# EAGLE design SuperDMG (EAGLE 7.3.0)
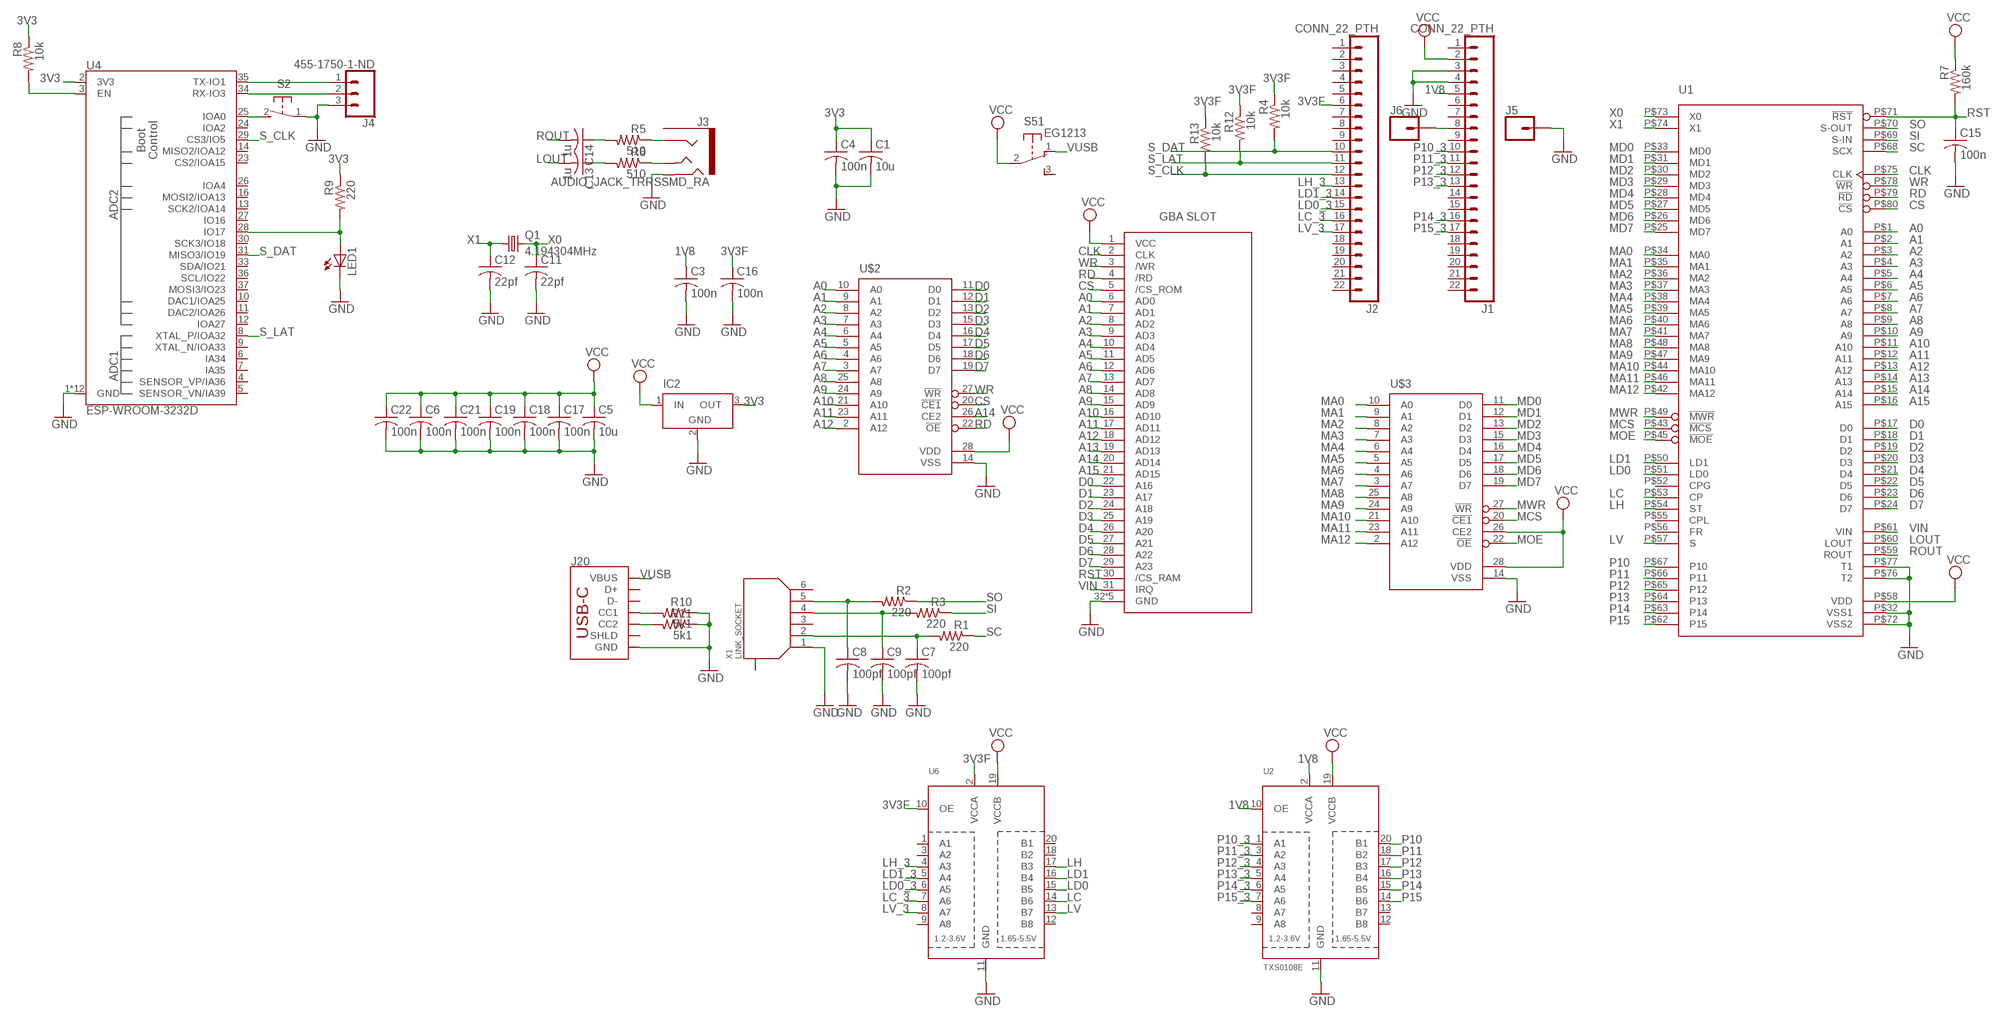
[diagram p0: schematic, sheet 1]

## Parts
C1  10u  C-USC0805  [C0805]
C3  100n  C-USC0805  [C0805]
C4  100n  C-USC0805  [C0805]
C5  10u  C-USC0805  [C0805]
C6  100n  C-USC0805  [C0805]
C7  100pf  C-USC0805  [C0805]
C8  100pf  C-USC0805  [C0805]
C9  100pf  C-USC0805  [C0805]
C11  22pf  C-USC0805  [C0805]
C12  22pf  C-USC0805  [C0805]
C13  1u  C-USC0805  [C0805]
C14  1u  C-USC0805  [C0805]
C15  100n  C-USC0805  [C0805]
C16  100n  C-USC0805  [C0805]
C17  100n  C-USC0805  [C0805]
C18  100n  C-USC0805  [C0805]
C19  100n  C-USC0805  [C0805]
C21  100n  C-USC0805  [C0805]
C22  100n  C-USC0805  [C0805]
IC2  LT1129CST5  [SOT223]
J1  CONN_22_PTH  [1X22]
J2  CONN_22_PTH  [1X22]
J3  AUDIO_JACK_TRRSSMD_RA  [AUDIO_JACK_3.5MM_TRRS_SMD_RA]
J4  455-1750-1-ND  CONN_03  [1X03]
J5  CONN_01  [1X01]
J6  CONN_01  [1X01]
J20  USB_C_2-LAYER_PADS  [USB-C-16P-2LAYER-PADS]
LED1  LEDCHIP-LED0805  [CHIP-LED0805]
Q1  4.194304MHz  CRYSTALHC49U-V  [HC49U-V]
R1  220  R-US_R0805  [R0805]
R2  220  R-US_R0805  [R0805]
R3  220  R-US_R0805  [R0805]
R4  10k  R-US_R0805  [R0805]
R5  510  R-US_R0805  [R0805]
R6  510  R-US_R0805  [R0805]
R7  160k  R-US_R0805  [R0805]
R8  10k  R-US_R0805  [R0805]
R9  220  R-US_R0805  [R0805]
R10  5k1  R-US_R0805  [R0805]
R11  5k1  R-US_R0805  [R0805]
R12  10k  R-US_R0805  [R0805]
R13  10k  R-US_R0805  [R0805]
S2  31-XX  [B3F-31XX]
S5  EG1213  [EG1213]
U1  CPU-1GDMG  [CPU-1G]
U2  TXS0108E  TXB0108PWR  [TSSOP20]
U4  ESP-WROOM-3232D  [ESP-WROOM-32D]
U6  TXB0108PWR  [TSSOP20]
U$1  GBA-SLOTSMD  [GBA-SLOT]
U$2  LH5264  [SO28]
U$3  LH5264  [SO28]
X1  LINK_SOCKET  [LINK_SOCKET]

## Nets
1V8: C3.1 J1.5 U2.2(VCCA) U2.10(OE)
3V3: C1.1 C4.1 IC2.3(OUT) R8.1 R9.1 U4.2(3V3)
3V3F: C16.1 J2.6 R4.1 R12.1 R13.1 U6.2(VCCA) U6.10(OE)
A0: U1.P$1(A0) U$1.6(AD0) U$2.10(A0)
A1: U1.P$2(A1) U$1.7(AD1) U$2.9(A1)
A2: U1.P$3(A2) U$1.8(AD2) U$2.8(A2)
A3: U1.P$4(A3) U$1.9(AD3) U$2.7(A3)
A4: U1.P$5(A4) U$1.10(AD4) U$2.6(A4)
A5: U1.P$6(A5) U$1.11(AD5) U$2.5(A5)
A6: U1.P$7(A6) U$1.12(AD6) U$2.4(A6)
A7: U1.P$8(A7) U$1.13(AD7) U$2.3(A7)
A8: U1.P$9(A8) U$1.14(AD8) U$2.25(A8)
A9: U1.P$10(A9) U$1.15(AD9) U$2.24(A9)
A10: U1.P$11(A10) U$1.16(AD10) U$2.21(A10)
A11: U1.P$12(A11) U$1.17(AD11) U$2.23(A11)
A12: U1.P$13(A12) U$1.18(AD12) U$2.2(A12)
A13: U1.P$14(A13) U$1.19(AD13)
A14: U1.P$15(A14) U$1.20(AD14) U$2.26(CE2)
A15: U1.P$16(A15) U$1.21(AD15)
CLK: U1.P$75(CLK) U$1.2(CLK)
CS: U1.P$80(!CS) U$1.5(/CS_ROM) U$2.20(!CE1)
D0: U1.P$17(D0) U$1.22(A16) U$2.11(D0)
D1: U1.P$18(D1) U$1.23(A17) U$2.12(D1)
D2: U1.P$19(D2) U$1.24(A18) U$2.13(D2)
D3: U1.P$20(D3) U$1.25(A19) U$2.15(D3)
D4: U1.P$21(D4) U$1.26(A20) U$2.16(D4)
D5: U1.P$22(D5) U$1.27(A21) U$2.17(D5)
D6: U1.P$23(D6) U$1.28(A22) U$2.18(D6)
D7: U1.P$24(D7) U$1.29(A23) U$2.19(D7)
GND: C1.2 C3.2 C4.2 C5.2 C6.2 C7.2 C8.2 C9.2 C11.2 C12.2 C15.2 C16.2 C17.2 C18.2 C19.2 C21.2 C22.2 IC2.2(GND) J1.3 J1.4 J3.RING2 J4.3 J5.1 J20.GND J20.GND2(GND) LED1.C R10.1 R11.1 S2.1(P) U1.P$32(VSS1) U1.P$72(VSS2) U1.P$76(T2) U1.P$77(T1) U2.11(GND) U4.1(GND) U4.15(GND) U4.38(GND) U4.GND U4.GNDT1(GND) U4.GNDT2(GND) U4.GNDT3(GND) U4.GNDT4(GND) U4.GNDT5(GND) U4.GNDT6(GND) U4.GNDT7(GND) U4.GNDT8(GND) U6.11(GND) U$1.32(GND) U$1.SHIELD_1(GND) U$1.SHIELD_2(GND) U$1.SHIELD_3(GND) U$1.SHIELD_4(GND) U$2.14(VSS) U$3.14(VSS) X1.1
LC: U1.P$53(CP) U6.14(B6)
LC_3: J2.16 U6.7(A6)
LD0: U1.P$51(LD0) U6.15(B5)
LD0_3: J2.15 U6.6(A5)
LD1: U1.P$50(LD1) U6.16(B4)
LD1_3: J2.14 U6.5(A4)
LH: U1.P$54(ST) U6.17(B3)
LH_3: J2.13 U6.4(A3)
LOUT: C13.2 U1.P$60(LOUT)
LV: U1.P$57(S) U6.13(B7)
LV_3: J2.17 U6.8(A7)
MA0: U1.P$34(MA0) U$3.10(A0)
MA1: U1.P$35(MA1) U$3.9(A1)
MA2: U1.P$36(MA2) U$3.8(A2)
MA3: U1.P$37(MA3) U$3.7(A3)
MA4: U1.P$38(MA4) U$3.6(A4)
MA5: U1.P$39(MA5) U$3.5(A5)
MA6: U1.P$40(MA6) U$3.4(A6)
MA7: U1.P$41(MA7) U$3.3(A7)
MA8: U1.P$48(MA8) U$3.25(A8)
MA9: U1.P$47(MA9) U$3.24(A9)
MA10: U1.P$44(MA10) U$3.21(A10)
MA11: U1.P$46(MA11) U$3.23(A11)
MA12: U1.P$42(MA12) U$3.2(A12)
MCS: U1.P$43(!MCS) U$3.20(!CE1)
MD0: U1.P$33(MD0) U$3.11(D0)
MD1: U1.P$31(MD1) U$3.12(D1)
MD2: U1.P$30(MD2) U$3.13(D2)
MD3: U1.P$29(MD3) U$3.15(D3)
MD4: U1.P$28(MD4) U$3.16(D4)
MD5: U1.P$27(MD5) U$3.17(D5)
MD6: U1.P$26(MD6) U$3.18(D6)
MD7: U1.P$25(MD7) U$3.19(D7)
MOE: U1.P$45(!MOE) U$3.22(!OE)
MWR: U1.P$49(!MWR) U$3.27(!WR)
N$1: C8.1 R2.2 X1.5
N$2: C9.1 R3.2 X1.4
N$3: J1.8 J6.1
N$4: C7.1 R1.2 X1.2
N$5: R8.2 U4.3(EN)
N$6: LED1.A R9.2 U4.28(IO17)
N$7: J3.RING1 R5.1
N$8: J20.A5(CC1) R10.2
N$9: J20.B5(CC2) R11.2
N$10: J3.TIP R6.1
N$11: C14.1 R5.2
N$12: C13.1 R6.2
N$14: S2.2(S) U4.25(IOA0)
P10: U1.P$67(P10) U2.20(B1)
P10_3: J1.10 U2.1(A1)
P11: U1.P$66(P11) U2.18(B2)
P11_3: J1.11 U2.3(A2)
P12: U1.P$65(P12) U2.17(B3)
P12_3: J1.12 U2.4(A3)
P13: U1.P$64(P13) U2.16(B4)
P13_3: J1.13 U2.5(A4)
P14: U1.P$63(P14) U2.15(B5)
P14_3: J1.16 U2.6(A5)
P15: U1.P$62(P15) U2.14(B6)
P15_3: J1.17 U2.7(A6)
RD: U1.P$79(!RD) U$1.4(/RD) U$2.22(!OE)
ROUT: C14.2 U1.P$59(ROUT)
RST: C15.1 R7.2 U1.P$71(!RST) U$1.30(/CS_RAM)
RX: J4.2 U4.34(RX-IO3)
S_CLK: J2.12 R13.2 U4.29(CS3/IO5)
S_DAT: J2.10 R4.2 U4.31(MISO3/IO19)
S_LAT: J2.11 R12.2 U4.8(XTAL_P/IOA32)
SC: R1.1 U1.P$68(SCX)
SI: R3.1 U1.P$69(S-IN)
SO: R2.1 U1.P$70(S-OUT)
TX: J4.1 U4.35(TX-IO1)
VCC: C5.1 C6.1 C17.1 C18.1 C19.1 C21.1 C22.1 IC2.1(IN) J1.2 R7.1 S5.2(1:P) U1.P$58(VDD) U2.19(VCCB) U6.19(VCCB) U$1.1(VCC) U$2.28(VDD) U$3.26(CE2) U$3.28(VDD)
VIN: U1.P$61(VIN) U$1.31(IRQ)
VUSB: J20.VBUS1(VBUS) J20.VBUS2(VBUS) S5.1(1:O)
WR: U1.P$78(!WR) U$1.3(/WR) U$2.27(!WR)
X0: C11.1 Q1.2 U1.P$73(X0)
X1: C12.1 Q1.1 U1.P$74(X1)
Unconnected: J1.1 J1.6 J1.7 J1.9 J1.14 J1.15 J1.18 J1.19 J1.20 J1.21 J1.22 J2.1 J2.2 J2.3 J2.4 J2.5 J2.7 J2.8 J2.9 J2.18 J2.19 J2.20 J2.21 J2.22 J3.EARTH J20.A6(D+) J20.A7(D-) J20.B6(D+) J20.B7(D-) J20.SHLD1(SHLD) J20.SHLD2(SHLD) J20.SHLD3(SHLD) J20.SHLD4(SHLD) S5.3(1:S) S5.MT1(MT) S5.MT2(MT) U1.P$52(CPG) U1.P$55(CPL) U1.P$56(FR) U2.8(A7) U2.9(A8) U2.12(B8) U2.13(B7) U4.4(SENSOR_VP/IA36) U4.5(SENSOR_VN/IA39) U4.6(IA34) U4.7(IA35) U4.9(XTAL_N/IOA33) U4.10(DAC1/IOA25) U4.11(DAC2/IOA26) U4.12(IOA27) U4.13(SCK2/IOA14) U4.14(MISO2/IOA12) U4.16(MOSI2/IOA13) U4.23(CS2/IOA15) U4.24(IOA2) U4.26(IOA4) U4.27(IO16) U4.30(SCK3/IO18) U4.33(SDA/IO21) U4.36(SCL/IO22) U4.37(MOSI3/IO23) U6.1(A1) U6.3(A2) U6.9(A8) U6.12(B8) U6.18(B2) U6.20(B1) X1.3 X1.6 X1.GND@1(GND) X1.GND@2(GND)

## Power pins joined to a net without a drawn wire
GND: IC2.4(GND)

## Library data of the parts
C1 C3-C9 C11-C19 C21 C22 = rcl:C-US: CAPACITOR, American symbol
IC2 = linear-technology:LT1129CST5: VOLTAGE REGULATOR with shutdown; MPN: LT1129CST-5#PBF; OC_FARNELL: 1663375; OC_NEWARK: 57M2069
J1 J2 = SparkFun-Connectors:CONN_22: Standard 22-pin 0.1" header; PROD_ID: CONN-13453
J3 = lbr_SparkFun-Eagle-Libraries_SparkFun-Connectors:AUDIO_JACK_TRRS: Audio Jack - 3.5mm TRRS (SMD) This is a 3.5mm TRRS SMD audio jack. TRRS connectors are the audio-style connectors that you see on some phones, MP3 players and development boards. TRRS stands for “tip, ring, ring, sleeve,” which reflects that this has three conductors and a ground. SparkFun Products: Audio Jack <https://www.sparkfun.com/products/12639> mbed Starter Kit <https://www.sparkfun.com/products/12968> SparkFun TRRS 3.5mm Jack Breakout <https://www.sparkfun.com/products/11570>; PROD_ID: CONN-10676; SF_ID: PRT-12639
J4 = SparkFun-Connectors:CONN_03: Multi connection point. Often used as Generic Header-pin footprint for 0.1 inch spaced/style header connections On any of the 0.1 inch spaced packages, you can populate with these: Break Away Headers - Straight (PRT-00116) Break Away Male Headers - Right Angle (PRT-00553) Female Headers (PRT-00115) Break Away Headers - Machine Pin (PRT-00117) Break Away Female Headers - Swiss Machine Pin (PRT-00743) Stackable Header - 3 Pin (Female, 0.1") (PRT-13875) For SCREWTERMINALS and SPRING TERMINALS visit here: Screw Terimnals on SparkFun.com (5mm/3.5mm/2.54mm spacing) This device is also useful as a general connection point to wire up your design to another part of your project. Our various solder wires solder well into these plated through hole pads. Hook-Up Wire - Assortment (Stranded, 22 AWG) (PRT-11375) Hook-Up Wire - Assortment (Solid Core, 22 AWG) (PRT-11367) View the entire wire category on our website here Special notes: Molex polarized connector foot print use with SKU : PRT-08232 with associated crimp pins and housings.; PROD_ID: XXX-00000
J5 J6 = SparkFun-Connectors:CONN_01: Single connection point. Often used as Generic Header-pin footprint for 0.1 inch spaced/style header connections On any of the 0.1 inch spaced packages, you can populate with these: Break Away Headers - Straight (PRT-00116) Break Away Male Headers - Right Angle (PRT-00553) Female Headers (PRT-00115) Break Away Headers - Machine Pin (PRT-00117) Break Away Female Headers - Swiss Machine Pin (PRT-00743) This device is also useful as a general connection point to wire up your design to another part of your project. Our various solder wires solder well into these plated through hole pads. Hook-Up Wire - Assortment (Stranded, 22 AWG) (PRT-11375) Hook-Up Wire - Assortment (Solid Core, 22 AWG) (PRT-11367) View the entire wire category on our website here Special notes: SMTSO-256-ET is a "flush mount" nut for a 4-40 screw. We mostly use this on specialty testbeds; it is a nice way to connect hardware to your PCB at an adjustable hieght. Also note, the SNAP packages are for using a snappable style connector. We sell a baggie of snaps and they are also used on two LilyPad designs: Snap Assortment - 30 pack (male and female) (DEV-11347) LilyPad Arduino SimpleSnap (DEV-10941) LilyPad SimpleSnap Protoboard (DEV-10940)
J20 = SparkFun-Connectors:USB_C: USB Type C 16Pin Connector Super Speed pins not available on the 16-pin purely SMD connector so this part is best for USB 2.0 implementations. D1 and D2 are tied together enabling D+/- no matter which way the cable is plugged into the connector. The two channel configuration pins (CC1/2) are exposed. These are normally connected to ground via 5.1k resistors but can be reconfigured for high current/high power applications. **4-LAYER BOARD WARNING!!** If designing 4-layer board, make sure to select the variant _4-LAYER-ISOLATED. The linked footprint (USB-C-16-4LAYER-ISOLATED) includes some very necessary cutout polygons in the inner layers (2 and 15). This prevents the PTH mounting shield legs on the USB connector from electrically connecting any other polygons on the inner layers (usually VCC and GND).; PROD_ID: CONN-14122
LED1 = led:LED: LED OSRAM: - CHIPLED LG R971, LG N971, LY N971, LG Q971, LY Q971, LO R971, LY R971 LH N974, LH R974 LS Q976, LO Q976, LY Q976 LO Q996 - Hyper CHIPLED LW Q18S LB Q993, LB Q99A, LB R99A - SideLED LS A670, LO A670, LY A670, LG A670, LP A670 LB A673, LV A673, LT A673, LW A673 LH A674 LY A675 LS A676, LA A676, LO A676, LY A676, LW A676 LS A679, LY A679, LG A679 - Hyper Micro SIDELED® LS Y876, LA Y876, LO Y876, LY Y876 LT Y87S - SmartLED LW L88C, LW L88S LB L89C, LB L89S, LG L890 LS L89K, LO L89K, LY L89K LS L896, LA L896, LO L896, LY L896 - TOPLED LS T670, LO T670, LY T670, LG T670, LP T670 LSG T670, LSP T670, LSY T670, LOP T670, LYG T670 LG T671, LOG T671, LSG T671 LB T673, LV T673, LT T673, LW T673 LH T674 LS T676, LA T676, LO T676, LY T676, LB T676, LH T676, LSB T676, LW T676 LB T67C, LV T67C, LT T67C, LS T67K, LO T67K, LY T67K, LW E67C LS E67B, LA E67B, LO E67B, LY E67B, LB E67C, LV E67C, LT E67C LW T67C LS T679, LY T679, LG T679 LS T770, LO T770, LY T770, LG T770, LP T770 LB T773, LV T773, LT T773, LW T773 LH T774 LS E675, LA E675, LY E675, LS T675 LS T776, LA T776, LO T776, LY T776, LB T776 LHGB T686 LT T68C, LB T68C - Hyper Mini TOPLED® LB M676 - Mini TOPLED Santana® LG M470 LS M47K, LO M47K, LY M47K Source: http://www.osram.convergy.de LUXEON: - LUMILED® LXK2-PW12-R00, LXK2-PW12-S00, LXK2-PW14-U00, LXK2-PW14-V00 LXK2-PM12-R00, LXK2-PM12-S00, LXK2-PM14-U00 LXK2-PE12-Q00, LXK2-PE12-R00, LXK2-PE12-S00, LXK2-PE14-T00, LXK2-PE14-U00 LXK2-PB12-K00, LXK2-PB12-L00, LXK2-PB12-M00, LXK2-PB14-N00, LXK2-PB14-P00, LXK2-PB14-Q00 LXK2-PR12-L00, LXK2-PR12-M00, LXK2-PR14-Q00, LXK2-PR14-R00 LXK2-PD12-Q00, LXK2-PD12-R00, LXK2-PD12-S00 LXK2-PH12-R00, LXK2-PH12-S00 LXK2-PL12-P00, LXK2-PL12-Q00, LXK2-PL12-R00 Source: www.luxeon.com KINGBRIGHT: KA-3528ASYC Source: www.kingbright.com
Q1 = crystal:CRYSTAL: CRYSTAL; OC_FARNELL: 1666969; OC_NEWARK: unknown
R1-R13 = rcl:R-US_: RESISTOR, American symbol
S2 = switch-omron:31-XX: OMRON SWITCH; MPN: B3F-3100; OC_FARNELL: 959704; OC_NEWARK: 36M3582
S5 = adafruit:EG1213: E-Switch right-angle slide SPDT Part #EG1213 http://www.ladyada.net/library/eagle
U1 = Game Boy:CPU-1G: First Generation Game Boy CPUs (DMG, MGB, SGB)
U2 U6 = adafruit:TXB0108PWR: 8-Bit Bi-Directional Level Shifter 1.2V-3.6V (VCCA) to 1.65V-5.5V (VCCB) bi-directional level shifter with auto direction sensing. Max data rate - VCCA 1.8V: 20Mbps (50ns), VCCA 3.3V: 100Mbps (10ns) Digikey: 296-21527-1-ND
U4 = SparkFun-RF:ESP-WROOM-32: ESP-WROOM-32D - trace antenna (includes keepout) ESP-WROOM-32U - U.FL antenna connector Includes both "standard" footprints and "narrow" version (for use with tighter layouts).; PROD_ID: IC-15676
U$1 = !sanni:GBA-SLOT
U$2 U$3 = Game Boy:LH5264
X1 = GBA:LINK_SOCKET

## Board
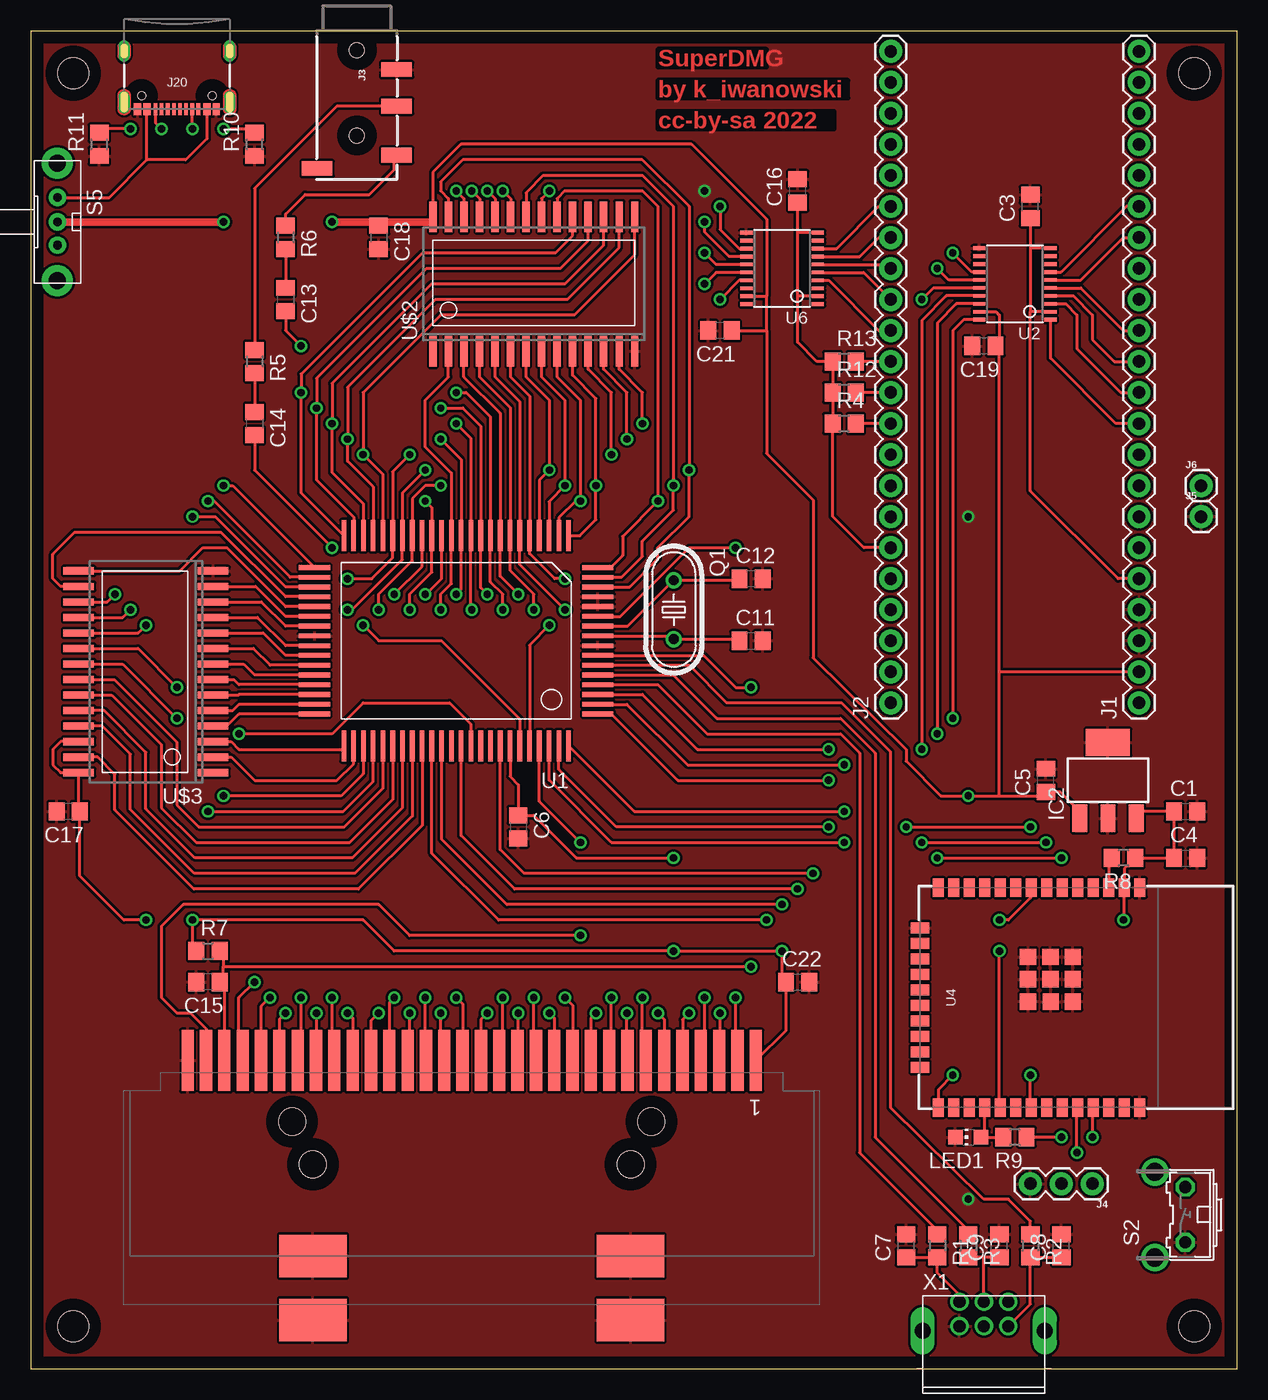
[diagram p1: board, top side]
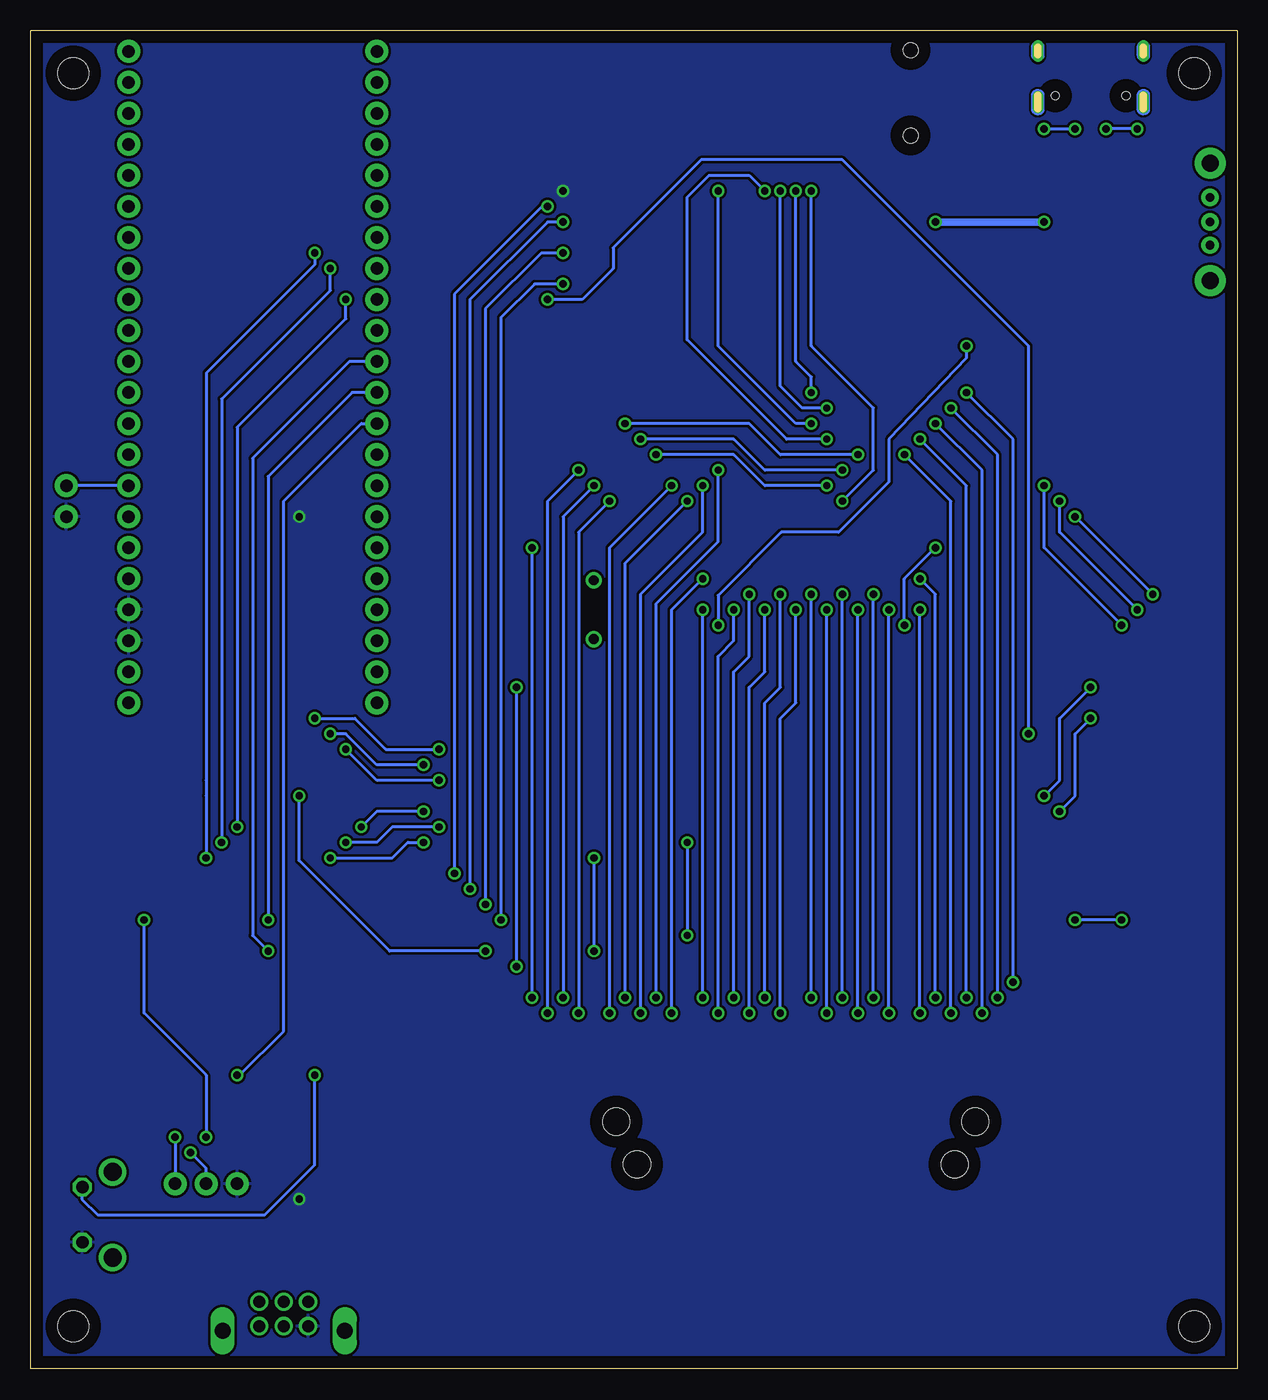
[diagram p2: board, bottom side, seen from below]

Size 98.74 x 109.58 mm. Coordinates in mm from the lower left corner, seen from the top.
Outline: 0,109.58 0,0 98.74,0 98.74,109.58 0,109.58
Copper layers (1*16): Top 0.035mm / dielectric 1.5mm / Bottom 0.035mm
Design rules "default *": minimum track width 8mil, minimum drill 24mil, track to track 8mil, track to pad 8mil, pad to pad 8mil, via to via 8mil, smd to smd 8mil, copper to edge 40mil, drill to drill 8mil, minimum pad ring 10mil, minimum via ring 8mil, stop-mask expansion 4mil, vias tented up to drill 0mil, thermal gap 8mil
Holes 2.5 mm at 3.5,106.08 95.24,106.08 3.5,3.5 95.24,3.5

### Footprints (pad centres in the part's own frame; a part is rotated, then mirrored left to right if it is on the bottom)
C0805 = smd 1.3 x 1.5: 1 -0.95,0; 2 0.95,0
SOT223 = smd 1.219 x 2.235: 1 -2.311,-3.099; 2 0,-3.099; 3 2.311,-3.099 | smd 3.6 x 2.2: 4 0,3.099
1X22 = drill 1.016 pad 1.88: 1 0,0; 2 2.54,0; 3 5.08,0; 4 7.62,0; 5 10.16,0; 6 12.7,0; 7 15.24,0; 8 17.78,0; 9 20.32,0; 10 22.86,0; 11 25.4,0; 12 27.94,0; 13 30.48,0; 14 33.02,0; 15 35.56,0; 16 38.1,0; 17 40.64,0; 18 43.18,0; 19 45.72,0; 20 48.26,0; 21 50.8,0; 22 53.34,0
AUDIO_JACK_3.5MM_TRRS_SMD_RA = smd 1.2 x 2.5: EARTH 11.3,-3.25; RING1 6.2,3.25; RING2 3.2,3.25; TIP 10.2,3.25 | hole 1.2: 1.6,0; 8.6,0
1X03 = drill 1.016 pad 1.88: 1 0,0; 2 2.54,0; 3 5.08,0
1X01 = drill 1.016 pad 1.88: 1 0,0
USB-C-16P-2LAYER-PADS = smd 0.3 x 1: A5 -1.25,-0.34; A6 -0.25,-0.34; A7 0.25,-0.34; A8 1.25,-0.34; B5 1.75,-0.34; B6 0.75,-0.34; B7 -0.75,-0.34; B8 -1.75,-0.34 | smd 0.6 x 1: GND -3.225,-0.34; GND2 3.225,-0.34; VBUS1 -2.45,-0.34; VBUS2 2.45,-0.34 | drill 0.4 pad 0.6 long: SHLD1 -4.318,-0.915; SHLD2 4.318,-0.915; SHLD3 -4.318,-5.095; SHLD4 4.318,-5.095 | hole 0.65: -2.89,-1.445; 2.89,-1.445
CHIP-LED0805 = smd 1.2 x 1.2: A 0,-1.05; C 0,1.05
HC49U-V = drill 0.813: 1 -2.413,0; 2 2.413,0
R0805 = smd 1.3 x 1.5: 1 -0.95,0; 2 0.95,0
B3F-31XX = drill 1.016 octagon: 1 -2.261,-1.245; 2 2.261,-1.245 | drill 1.499 pad 2.159: 3 -3.505,1.245; 4 3.505,1.245
EG1213 = drill 0.7 pad 1.422: 1 -2,0; 2 0,0; 3 1.9,0 | drill 1.4 pad 2.54: MT1 -4.8,0; MT2 4.8,0
CPU-1G = smd 0.381 x 2.54: P$1 -9.2,-8.6; P$2 -8.4,-8.6; P$3 -7.6,-8.6; P$4 -6.8,-8.6; P$5 -6,-8.6; P$6 -5.2,-8.6; P$7 -4.4,-8.6; P$8 -3.6,-8.6; P$9 -2.8,-8.6; P$10 -2,-8.6; P$11 -1.2,-8.6; P$12 -0.4,-8.6; P$13 0.4,-8.6; P$14 1.2,-8.6; P$15 2,-8.6; P$16 2.8,-8.6; P$17 3.6,-8.6; P$18 4.4,-8.6; P$19 5.2,-8.6; P$20 6,-8.6; P$21 6.8,-8.6; P$22 7.6,-8.6; P$23 8.4,-8.6; P$24 9.2,-8.6; P$41 9.2,8.6; P$42 8.4,8.6; P$43 7.6,8.6; P$44 6.8,8.6; P$45 6,8.6; P$46 5.2,8.6; P$47 4.4,8.6; P$48 3.6,8.6; P$49 2.8,8.6; P$50 2,8.6; P$51 1.2,8.6; P$52 0.4,8.6; P$53 -0.4,8.6; P$54 -1.2,8.6; P$55 -2,8.6; P$56 -2.8,8.6; P$57 -3.6,8.6; P$58 -4.4,8.6; P$59 -5.2,8.6; P$60 -6,8.6; P$61 -6.8,8.6; P$62 -7.6,8.6; P$63 -8.4,8.6; P$64 -9.2,8.6 | smd 2.54 x 0.381: P$25 11.6,-6; P$26 11.6,-5.2; P$27 11.6,-4.4; P$28 11.6,-3.6; P$29 11.6,-2.8; P$30 11.6,-2; P$31 11.6,-1.2; P$32 11.6,-0.4; P$33 11.6,0.4; P$34 11.6,1.2; P$35 11.6,2; P$36 11.6,2.8; P$37 11.6,3.6; P$38 11.6,4.4; P$39 11.6,5.2; P$40 11.6,6; P$65 -11.6,6; P$66 -11.6,5.2; P$67 -11.6,4.4; P$68 -11.6,3.6; P$69 -11.6,2.8; P$70 -11.6,2; P$71 -11.6,1.2; P$72 -11.6,0.4; P$73 -11.6,-0.4; P$74 -11.6,-1.2; P$75 -11.6,-2; P$76 -11.6,-2.8; P$77 -11.6,-3.6; P$78 -11.6,-4.4; P$79 -11.6,-5.2; P$80 -11.6,-6
TSSOP20 = smd 0.305 x 0.991: 1 -2.925,-2.918; 2 -2.275,-2.918; 3 -1.625,-2.918; 4 -0.975,-2.918; 5 -0.325,-2.918; 6 0.325,-2.918; 7 0.975,-2.918; 8 1.625,-2.918; 9 2.275,-2.918; 10 2.925,-2.918; 11 2.925,2.918; 12 2.275,2.918; 13 1.625,2.918; 14 0.975,2.918; 15 0.325,2.918; 16 -0.325,2.918; 17 -0.975,2.918; 18 -1.625,2.918; 19 -2.275,2.918; 20 -2.925,2.918
ESP-WROOM-32D = smd 0.9 x 1.5: 1 7.7,9; 2 6.43,9; 3 5.16,9; 4 3.89,9; 5 2.62,9; 6 1.35,9; 7 0.08,9; 8 -1.19,9; 9 -2.46,9; 10 -3.73,9; 11 -5,9; 12 -6.27,9; 13 -7.54,9; 14 -8.81,9; 25 -8.81,-9; 26 -7.54,-9; 27 -6.27,-9; 28 -5,-9; 29 -3.73,-9; 30 -2.46,-9; 31 -1.19,-9; 32 0.08,-9; 33 1.35,-9; 34 2.62,-9; 35 3.89,-9; 36 5.16,-9; 37 6.43,-9; 38 7.7,-9 | smd 1.5 x 0.9: 15 -10.3,5.715; 16 -10.3,4.445; 17 -10.3,3.175; 18 -10.3,1.905; 19 -10.3,0.635; 20 -10.3,-0.635; 21 -10.3,-1.905; 22 -10.3,-3.175; 23 -10.3,-4.445; 24 -10.3,-5.715 | smd 1.33 x 1.33: GND 0.379,1.515; GNDT1 -1.46,3.33; GNDT2 -1.47,1.5; GNDT3 -1.46,-0.33; GNDT4 0.4,-0.34; GNDT5 2.2,-0.33; GNDT6 2.2,1.5; GNDT7 2.2,3.33; GNDT8 0.37,3.33
GBA-SLOT = smd 5 x 1: 1 -5,23.25; 2 -5,21.75; 3 -5,20.25; 4 -5,18.75; 5 -5,17.25; 6 -5,15.75; 7 -5,14.25; 8 -5,12.75; 9 -5,11.25; 10 -5,9.75; 11 -5,8.25; 12 -5,6.75; 13 -5,5.25; 14 -5,3.75; 15 -5,2.25; 16 -5,0.75; 17 -5,-0.75; 18 -5,-2.25; 19 -5,-3.75; 20 -5,-5.25; 21 -5,-6.75; 22 -5,-8.25; 23 -5,-9.75; 24 -5,-11.25; 25 -5,-12.75; 26 -5,-14.25; 27 -5,-15.75; 28 -5,-17.25; 29 -5,-18.75; 30 -5,-20.25; 31 -5,-21.75; 32 -5,-23.25 | smd 3.5 x 5.5: SHIELD_1 11,13; SHIELD_2 11,-13; SHIELD_3 16.25,13; SHIELD_4 16.25,-13 | hole 2.2: 0,14.7; 0,-14.7; 3.5,13; 3.5,-13
SO28 = smd 0.6 x 2.5: 1 -8.255,-5.5; 2 -6.985,-5.5; 3 -5.715,-5.5; 4 -4.445,-5.5; 5 -3.175,-5.5; 6 -1.905,-5.5; 7 -0.635,-5.5; 8 0.635,-5.5; 9 1.905,-5.5; 10 3.175,-5.5; 11 4.445,-5.5; 12 5.715,-5.5; 13 6.985,-5.5; 14 8.255,-5.5; 15 8.255,5.5; 16 6.985,5.5; 17 5.715,5.5; 18 4.445,5.5; 19 3.175,5.5; 20 1.905,5.5; 21 0.635,5.5; 22 -0.635,5.5; 23 -1.905,5.5; 24 -3.175,5.5; 25 -4.445,5.5; 26 -5.715,5.5; 27 -6.985,5.5; 28 -8.255,5.5
LINK_SOCKET = drill 1: 1 -2,-1; 2 -2,1; 3 0,-1; 4 0,1; 5 2,-1; 6 2,1 | drill 1.3 long: GND@1 -5,-1.375; GND@2 5,-1.375

### Placement (x,y rotation side)
C1  94.53,45.65 0 top
C3  81.83,95.18 90 top
C4  94.53,41.84 0 top
C5  83.1,48.19 90 top
C6  39.92,44.38 270 top
C7  71.67,10.09 90 top
C8  84.37,10.09 90 top
C9  79.29,10.09 90 top
C11  58.97,59.62 0 top
C12  58.97,64.7 0 top
C13  20.87,87.56 270 top
C14  18.33,77.4 270 top
C15  14.52,31.68 180 top
C16  62.78,96.45 90 top
C17  3.09,45.65 180 top
C18  28.49,92.64 270 top
C19  78.02,83.75 180 top
C21  56.43,85.02 180 top
C22  62.78,31.68 0 top
IC2  88.18,48.19 0 top
J1  90.72,54.54 90 top
J2  70.4,54.54 90 top
J3  26.71,109.58 270 top
J4  86.91,15.17 180 top
J5  95.8,69.78 0 top
J6  95.8,72.32 0 top
J20  11.98,102.8 180 top
LED1  76.75,18.98 90 top
Q1  52.65,62.16 270 top
R1  74.21,10.09 270 top
R2  81.83,10.09 270 top
R3  76.75,10.09 270 top
R4  66.59,77.4 0 top
R5  18.33,82.48 270 top
R6  20.87,92.64 270 top
R7  14.52,34.22 0 top
R8  89.45,41.84 180 top
R9  80.56,18.98 180 top
R10  18.33,100.26 90 top
R11  5.63,100.26 90 top
R12  66.59,79.94 0 top
R13  66.59,82.48 0 top
S2  93.26,12.63 90 top
S5  2.2,93.91 270 top
U1  34.84,59.62 180 top
U2  80.56,88.83 90 top
U4  83.1,30.41 0 top
U6  61.51,90.1 90 top
U$1  36.11,20.25 270 top
U$2  41.19,88.83 0 top
U$3  9.44,57.08 90 top
X1  78.02,4.5 0 top

### Tracks (layer width: path | path; a pad name or v marks a point on that pad's centre or on a via)
1V8
  Top 0.254: U2.10 81.83,91.75 | 81.83,91.75 81.83,86.55 | U2.2 81.83,86.55 | J1.5 89.01,64.7 81.83,71.88 81.83,86.55 | C3.1 81.83,91.75
3V3  (via drill 0.6)
  Top 0.254: v89.45,36.76 89.53,36.76 U4.2 89.53,40.97 R8.1 C4.1 C1.1 90.49,45.65 IC2.3 | v84.37,18.98 R9.1
  Bottom 0.254: v84.37,18.98 84.37,24.06 89.45,29.14 v89.45,36.76
3V3F
  Top 0.254: U6.10 62.78,93.02 | 62.78,93.02 C16.1 | U6.2 62.78,87.83 | 62.78,87.83 62.78,93.02 | J2.6 68.2,67.24 65.64,69.8 R4.1 R12.1 R13.1 64.35,82.48 62.78,84.05 62.78,87.83
A0  (via drill 0.6)
  Top 0.254: v51.35,29.14 51.86,28.63 U$1.6 | U1.P$1 44.97,68.22 46.27,69.52 v46.27,72.32 46.27,79.45 44.37,81.36 U$2.10
  Bottom 0.254: v51.35,29.14 51.35,67.24 v46.27,72.32
A1  (via drill 0.6)
  Top 0.254: U$1.7 50.08,25.25 v50.08,30.41 | U$2.9 43.09,81.21 45,79.3 v45,71.05 44.6,71.05 43.24,69.69 U1.P$2
  Bottom 0.254: v50.08,30.41 50.08,65.97 v45,71.05
A2  (via drill 0.6)
  Top 0.254: U$1.8 48.81,25.25 v48.81,29.14 | U$2.8 41.83,81.21 43.73,79.3 v43.73,72.32 42.44,71.01 U1.P$3
  Bottom 0.254: v48.81,29.14 48.81,63.43 43.73,68.51 v43.73,72.32
A3  (via drill 0.6)
  Top 0.254: U$1.9 47.54,25.25 v47.54,30.41 | U$2.7 40.55,81.21 42.46,79.3 v42.46,73.59 41.64,72.77 U1.P$4
  Bottom 0.254: v47.54,30.41 47.54,62.66 42.46,67.74 v42.46,73.59
A4  (via drill 0.6)
  Top 0.254: v46.27,29.14 45.86,28.73 U$1.10 | v43.73,64.7 42.9,64.7 40.84,66.76 U1.P$5 40.84,79.66 39.29,81.21 U$2.6
  Bottom 0.254: v46.27,29.14 46.27,62.16 v43.73,64.7
A5  (via drill 0.6)
  Top 0.254: v43.73,30.41 44.36,29.78 U$1.11 | v43.73,62.16 40.04,65.85 U1.P$6 40.04,79.19 38.02,81.21 U$2.5
  Bottom 0.254: v43.73,30.41 v43.73,62.16
A6  (via drill 0.6)
  Top 0.254: v42.46,29.14 42.86,28.74 U$1.12 | v41.19,62.16 41.19,63.43 39.24,65.38 U1.P$7 39.24,78.72 36.75,81.21 U$2.4
  Bottom 0.254: v42.46,29.14 42.46,58.35 41.19,59.62 v41.19,62.16
A7  (via drill 0.6)
  Top 0.254: U$1.13 41.19,25.25 v41.19,30.41 | v39.92,63.43 38.44,64.91 U1.P$8 38.44,78.24 35.48,81.21 U$2.3
  Bottom 0.254: v41.19,30.41 41.19,57.08 39.92,58.35 v39.92,63.43
A8  (via drill 0.6)
  Top 0.254: U$1.14 39.92,25.25 v39.92,29.14 | v38.65,62.16 38.65,63.43 37.64,64.44 U1.P$9 37.64,77.95 35.65,79.94 v34.84,79.94 | v36.11,96.45 36.75,95.81 U$2.25
  Bottom 0.254: v39.92,29.14 39.92,55.81 38.65,57.08 v38.65,62.16 | v34.84,79.94 34.84,81.21 36.11,82.48 v36.11,96.45
A9  (via drill 0.6)
  Top 0.254: U$1.15 38.65,25.25 v38.65,30.41 | v37.38,63.43 36.84,63.97 U1.P$10 36.84,77.2 35.38,78.67 v33.57,78.67 | v37.38,96.45 38.02,95.81 U$2.24
  Bottom 0.254: v38.65,30.41 38.65,54.54 37.38,55.81 v37.38,63.43 | v33.57,78.67 35.58,78.67 37.38,80.47 v37.38,96.45
A10  (via drill 0.6)
  Top 0.254: v37.38,29.14 36.86,28.62 U$1.16 | v36.11,62.16 36.04,62.23 U1.P$11 | v42.46,96.45 41.83,95.81 U$2.21 | U1.P$11 36.11,68.22 | v34.84,77.4 36.04,76.2 U1.P$11
  Bottom 0.254: v37.38,29.14 37.38,53.27 36.11,54.54 v36.11,62.16 | v34.84,77.4 36.11,77.4 42.46,83.75 v42.46,96.45
A11  (via drill 0.6)
  Top 0.254: v34.84,30.41 35.36,29.89 U$1.17 | v34.84,63.43 35.24,63.83 U1.P$12 35.24,74.46 v33.57,76.13 | v38.65,96.45 39.29,95.81 U$2.23
  Bottom 0.254: v34.84,30.41 v34.84,63.43 | v33.57,76.13 36.87,76.13 45,84.26 45,95.92 43.2,97.72 39.92,97.72 v38.65,96.45
A12  (via drill 0.6)
  Top 0.254: U$1.18 33.57,25.25 v33.57,29.14 | v33.57,62.16 33.57,63.43 34.44,64.3 U1.P$13 34.44,73.35 32.3,75.49 32.3,79.3 34.2,81.21 U$2.2
  Bottom 0.254: v33.57,29.14 v33.57,62.16
A13  (via drill 0.6)
  Top 0.254: U$1.19 32.3,25.25 v32.3,30.41 | v32.3,63.43 32.3,63.36 33.64,64.7 U1.P$14
  Bottom 0.254: v32.3,30.41 v32.3,63.43
A14  (via drill 0.6)
  Top 0.254: U$1.20 31.03,25.25 v31.03,29.14 | v31.03,62.16 31.03,63.43 32.84,65.24 U1.P$15 32.84,70.51 v32.3,71.05 | v34.84,96.45 35.48,95.81 U$2.26
  Bottom 0.254: v31.03,29.14 v31.03,62.16 | v32.3,71.05 29.76,73.59 29.76,78.67 34.84,83.75 v34.84,96.45
A15  (via drill 0.6)
  Top 0.254: v29.76,30.41 29.36,30.01 U$1.21 | v29.76,63.43 32.04,65.71 U1.P$16
  Bottom 0.254: v29.76,30.41 v29.76,63.43
CLK  (via drill 0.6)
  Top 0.254: v57.7,67.24 53.89,67.24 48.27,61.62 U1.P$75 | U$1.2 57.7,25.25 v57.7,30.41
  Bottom 0.254: v57.7,67.24 v57.7,30.41
CS  (via drill 0.6)
  Top 0.254: U1.P$80 47.48,65.62 48.46,66.6 48.46,68.16 v51.35,71.05 51.35,95.18 50.08,96.45 43.73,96.45 43.09,95.81 U$2.20 | v53.89,29.14 53.36,28.61 U$1.5
  Bottom 0.254: v51.35,71.05 53.89,68.51 v53.89,29.14
D0  (via drill 0.6)
  Top 0.254: v28.49,29.14 27.86,28.51 U$1.22 | v28.49,62.16 28.49,63.43 31.24,66.18 U1.P$17 31.24,71.26 32.3,72.32 v33.57,72.32 | U$2.11 45.63,81.84 47.54,79.94 v47.54,74.86
  Bottom 0.254: v28.49,29.14 v28.49,62.16 | v33.57,72.32 38.65,72.32 41.19,74.86 v47.54,74.86
D1  (via drill 0.6)
  Top 0.254: v25.95,29.14 26.36,28.73 U$1.23 | v25.95,62.16 26.34,62.16 30.44,66.26 U1.P$18 30.44,71.73 v32.3,73.59 | U$2.12 46.91,81.84 48.81,79.94 v48.81,76.13
  Bottom 0.254: v25.95,29.14 v25.95,62.16 | v32.3,73.59 38.65,73.59 41.19,76.13 v48.81,76.13
D2  (via drill 0.6)
  Top 0.254: U$1.24 24.68,25.25 v24.68,30.41 | v25.95,64.7 27.93,64.7 29.64,66.41 U1.P$19 29.64,73.47 v31.03,74.86 | U$2.13 48.18,81.84 50.08,79.94 v50.08,77.4
  Bottom 0.254: v24.68,30.41 24.68,63.43 v25.95,64.7 | v31.03,74.86 37.38,74.86 39.92,77.4 v50.08,77.4
D3  (via drill 0.6)
  Top 0.254: U$1.25 23.41,25.25 v23.41,29.14 | U$2.15 49.45,91.25 44.48,86.29 33.57,86.29 27.22,79.94 v27.22,74.86 27.24,74.86 28.84,73.26 U1.P$20
  Bottom 0.254: v23.41,29.14 23.41,71.05 v27.22,74.86
D4  (via drill 0.6)
  Top 0.254: U$1.26 22.14,25.25 v22.14,30.41 | U$2.16 48.18,91.82 43.91,87.56 33.13,87.56 25.95,80.38 v25.95,76.13 25.95,74.32 28.04,72.23 U1.P$21
  Bottom 0.254: v22.14,30.41 22.14,72.32 v25.95,76.13
D5  (via drill 0.6)
  Top 0.254: v20.87,29.14 20.36,28.63 U$1.27 | U$2.17 46.91,92 43.73,88.83 32.81,88.83 24.68,80.7 v24.68,77.4 24.68,73.4 27.24,70.84 U1.P$22 27.24,68.51 27.22,68.51
  Bottom 0.254: v20.87,29.14 20.87,73.59 v24.68,77.4
D6  (via drill 0.6)
  Top 0.254: v19.6,30.41 18.86,29.67 U$1.28 | U$2.18 45.63,92.39 43.34,90.1 32.39,90.1 23.41,81.12 v23.41,78.67 23.41,72.78 26.44,69.75 U1.P$23
  Bottom 0.254: v19.6,30.41 19.6,74.86 v23.41,78.67
D7  (via drill 0.6)
  Top 0.254: U$1.29 17.06,25.25 17.06,30.41 v18.33,31.68 | U$2.19 44.37,92.79 42.95,91.37 32.06,91.37 22.14,81.45 v22.14,79.94 22.14,71.72 U1.P$24
  Bottom 0.254: v18.33,31.68 18.33,76.13 v22.14,79.94
GND  (via drill 0.6)
  other vias: 76.75,13.9 55.16,96.45 76.75,69.78
  pour Bottom: -0.72,110.42 99.61,110.42 99.61,-1.34 -0.72,-1.34
  pour Top: 99.61,110.42 99.61,-1.34 -0.72,-1.34 -0.72,110.42
LC  (via drill 0.6)
  Top 0.254: v62.78,39.3 39.61,39.3 35.24,43.67 U1.P$53 | U6.14 57.18,91.08 55.16,93.09 v55.16,93.91
  Bottom 0.254: v55.16,93.91 56.43,93.91 62.78,87.56 v62.78,39.3
LC_3
  Top 0.254: U6.7 67.86,91.08 69.42,92.64 J2.16
LD0  (via drill 0.6)
  Top 0.254: U6.15 56.11,90.42 v55.16,91.37 | v61.51,38.03 38.98,38.03 33.64,43.37 U1.P$51
  Bottom 0.254: v55.16,91.37 56.93,91.37 61.51,86.79 v61.51,38.03
LD0_3
  Top 0.254: U6.6 70.08,90.42 J2.15
LD1  (via drill 0.6)
  Top 0.254: v60.24,36.76 38.3,36.76 32.84,42.22 U1.P$50 | U6.16 56.11,89.77 v55.16,88.83
  Bottom 0.254: v55.16,88.83 57.49,88.83 60.24,86.08 v60.24,36.76
LD1_3
  Top 0.254: U6.5 68.19,89.77 J2.14
LH  (via drill 0.6)
  Top 0.254: U6.17 58,89.12 v56.43,87.56 | U1.P$54 36.04,52.79 34.29,54.54 27.22,54.54 24.68,52 v17.06,52
  Bottom 0.254: v17.06,52 17.06,83.75 32.3,98.99 43.86,98.99 51.05,91.8 51.05,90.1 53.59,87.56 v56.43,87.56
LH_3
  Top 0.254: U6.4 65.33,89.12 69.43,85.02 J2.13
LOUT  (via drill 0.6)
  Top 0.254: C13.2 20.87,85.02 v22.14,83.75 | v42.46,60.89 40.84,59.27 U1.P$60
  Bottom 0.254: v22.14,83.75 22.14,82.78 28.49,76.13 28.49,72.62 32.6,68.51 37.29,68.51 42.46,63.34 v42.46,60.89
LV  (via drill 0.6)
  Top 0.254: v64.05,40.57 40.39,40.57 38.44,42.52 U1.P$57 | U6.13 58,91.72 56.43,93.29 v56.43,95.18
  Bottom 0.254: v56.43,95.18 56.87,95.18 64.05,88 v64.05,40.57
LV_3
  Top 0.254: U6.8 65.97,91.72 69.43,95.18 J2.17
MA0
  Top 0.254: U1.P$34 20.87,58.42 19.04,60.25 U$3.10
MA1
  Top 0.254: U1.P$35 19.6,57.62 18.23,58.98 U$3.9
MA2
  Top 0.254: U1.P$36 18.33,56.82 17.44,57.71 U$3.8
MA3
  Top 0.254: U1.P$37 17.06,56.02 16.64,56.44 U$3.7
MA4
  Top 0.254: U$3.6 17.02,55.17 17.06,55.22 U1.P$38
MA5
  Top 0.254: U1.P$39 17.06,54.42 16.55,53.9 U$3.5
MA6
  Top 0.254: U$3.4 16.08,52.63 17.06,53.62 U1.P$40
MA7
  Top 0.254: 25.64,51.36 U1.P$41 25.64,50.73 17.06,50.73 16.43,51.36 U$3.3
MA8
  Top 0.254: U1.P$48 31.24,45.27 26.54,40.57 13.41,40.57 8.17,45.81 8.17,50.34 5.88,52.63 U$3.25
MA9
  Top 0.254: U1.P$47 30.44,45.94 26.34,41.84 13.46,41.84 9.44,45.86 9.44,50.48 6.02,53.9 U$3.24
MA10  (via drill 0.6)
  Top 0.254: v14.52,45.65 25.59,45.65 28.04,48.1 U1.P$44 | U$3.21 7.54,57.71 v11.98,53.27
  Bottom 0.254: v14.52,45.65 13.25,46.92 13.25,52 v11.98,53.27
MA11
  Top 0.254: U1.P$46 29.64,46.62 26.13,43.11 13.55,43.11 10.71,45.95 10.71,51.11 6.64,55.17 U$3.23
MA12
  Top 0.254: U1.P$42 26.44,49.55 25.08,48.19 18.33,48.19 16.43,50.09 U$3.2
MCS  (via drill 0.6)
  Top 0.254: U1.P$43 27.22,51.02 27.22,48.72 25.42,46.92 v15.79,46.92 | U$3.20 8.8,58.98 v11.98,55.81
  Bottom 0.254: v15.79,46.92 14.52,48.19 14.52,53.27 v11.98,55.81
MD0
  Top 0.254: U1.P$33 20.87,59.22 18.57,61.52 U$3.11
MD1
  Top 0.254: U1.P$31 20.87,60.82 18.89,62.8 U$3.12
MD2
  Top 0.254: U1.P$30 20.87,61.62 18.43,64.06 U$3.13
MD3
  Top 0.254: U1.P$29 20.87,62.42 16.05,67.24 14.1,67.24 12.19,65.33 U$3.15
MD4
  Top 0.254: U1.P$28 20.87,63.22 15.58,68.51 3.62,68.51 1.82,66.71 1.82,64.7 2.46,64.06 U$3.16
MD5  (via drill 0.6)
  Top 0.254: U$3.17 6.27,62.8 v6.9,63.43 | U1.P$27 20.87,64.02 15.11,69.78 v13.25,69.78
  Bottom 0.254: v6.9,63.43 v13.25,69.78
MD6  (via drill 0.6)
  Top 0.254: U$3.18 7.54,61.52 v8.17,62.16 | U1.P$26 21.25,64.82 15.02,71.05 v14.52,71.05
  Bottom 0.254: v8.17,62.16 14.52,68.51 v14.52,71.05
MD7  (via drill 0.6)
  Top 0.254: U$3.19 8.8,60.25 v9.44,60.89 | U1.P$25 16.54,72.32 v15.79,72.32
  Bottom 0.254: v9.44,60.89 15.79,67.24 v15.79,72.32
MOE
  Top 0.254: U1.P$45 28.84,47.54 25.68,44.38 13.78,44.38 11.98,46.18 11.98,51.32 6.86,56.44 U$3.22
MWR
  Top 0.254: U1.P$49 32.04,44.51 26.83,39.3 13.38,39.3 6.9,45.78 6.9,48.67 5.48,50.09 U$3.27
N$1
  Top 0.254: X1.5 81.83,5.31 R2.2 C8.1
N$2
  Top 0.254: C9.1 78.02,9.14 | 78.02,9.14 R3.2 | X1.4 78.02,9.14
N$3
  Bottom 0.254: J1.8 J6.1
N$4
  Top 0.254: C7.1 R1.2 74.21,7.87 76.02,6.06 X1.2
N$5
  Top 0.254: R8.2 88.26,41.84 U4.3
N$6
  Top 0.254: 78.1,18.98 U4.28 | LED1.A 78.1,18.98 | 78.1,18.98 R9.2
N$7
  Top 0.254: J3.RING1 25.04,103.38 18.33,96.67 R5.1
N$8  (via drill 0.6)
  Top 0.254: v13.25,101.53 13.23,101.53 J20.A5 | v15.79,101.53 18.33,101.53 R10.2
  Bottom 0.254: v15.79,101.53 v13.25,101.53
N$9  (via drill 0.6)
  Top 0.254: v10.71,101.53 10.23,102.01 J20.B5 | v8.17,101.53 5.63,101.53 R11.2
  Bottom 0.254: v8.17,101.53 v10.71,101.53
N$10
  Top 0.254: J3.TIP 29.76,99.38 29.76,98.17 27.74,96.15 22.47,96.15 20.87,94.55 R6.1
N$11
  Top 0.254: R5.2 C14.1
N$12
  Top 0.254: R6.2 C13.1
N$14  (via drill 0.6)
  Top 0.254: v75.48,24.06 74.29,22.87 U4.25
  Bottom 0.254: S2.2 94.53,14.89 94.53,13.9 93.26,12.63 79.56,12.63 75.48,16.71 v75.48,24.06
P10  (via drill 0.6)
  Top 0.254: U1.P$67 50.08,55.22 54.57,50.73 v65.32,50.73 | U2.20 76.36,85.91 75.48,85.02 v75.48,53.27
  Bottom 0.254: v75.48,53.27 72.2,53.27 69.66,50.73 v65.32,50.73
P10_3
  Top 0.254: J1.10 88.82,77.4 83.48,82.74 U2.1
P11  (via drill 0.6)
  Top 0.254: U1.P$66 48.81,54.42 53.77,49.46 v66.59,49.46 | U2.18 75.78,87.2 74.21,85.64 v74.21,52
  Bottom 0.254: v66.59,49.46 70.4,49.46 72.94,52 v74.21,52
P11_3
  Top 0.254: J1.11 89.23,79.94 85.64,83.53 85.64,86.29 84.72,87.2 U2.3
P12  (via drill 0.6)
  Top 0.254: U1.P$65 47.54,53.62 52.97,48.19 v65.32,48.19 | U2.17 74.95,87.85 72.94,85.84 v72.94,50.73
  Bottom 0.254: v65.32,48.19 70.4,48.19 v72.94,50.73
P12_3
  Top 0.254: J1.12 88.71,82.48 86.91,84.28 86.91,86.29 85.34,87.85 U2.4
P13  (via drill 0.6)
  Top 0.254: U1.P$64 49.41,45.65 v66.59,45.65 | U2.16 73.89,88.5 v72.94,87.56 | v71.67,44.38 v81.83,44.38
  Bottom 0.254: v81.83,44.38 81.83,77.1 72.94,85.99 v72.94,87.56 | v66.59,45.65 70.4,45.65 v71.67,44.38
P13_3
  Top 0.254: U2.5 85.97,88.5 89.45,85.02 J1.13
P14  (via drill 0.6)
  Top 0.254: v65.32,44.38 47.95,44.38 43.24,49.09 U1.P$63 | U2.15 75.16,89.16 v74.21,90.1 | v72.94,43.11 v83.1,43.11
  Bottom 0.254: v83.1,43.11 83.1,79.41 74.21,88.3 v74.21,90.1 | v65.32,44.38 69.13,44.38 70.4,43.11 v72.94,43.11
P14_3
  Top 0.254: U2.6 85.97,89.16 89.45,92.64 J1.16
P15  (via drill 0.6)
  Top 0.254: 42.46,51.02 U1.P$62 42.44,48.21 47.54,43.11 v66.59,43.11 | U2.14 77.05,89.8 v75.48,91.37 | v74.21,41.84 v84.37,41.84
  Bottom 0.254: v75.48,91.37 75.48,90.4 84.34,81.54 84.34,77.7 84.37,48.19 84.37,46.92 v84.37,41.84 | v74.21,41.84 69.13,41.84 67.86,43.11 v66.59,43.11
P15_3
  Top 0.254: U2.7 84.34,89.8 89.71,95.18 J1.17
RD  (via drill 0.6)
  Top 0.254: U1.P$79 48.37,64.82 50.08,66.53 50.08,67.77 52.62,70.31 v52.62,72.32 52.62,95.18 50.08,97.72 41.98,97.72 40.55,96.3 U$2.22 | U$1.4 55.16,25.25 v55.16,30.41
  Bottom 0.254: v52.62,72.32 55.16,69.78 v55.16,30.41
ROUT  (via drill 0.6)
  Top 0.254: C14.2 18.33,73.59 v24.68,67.24 | v27.22,60.89 28.49,59.62 33.62,59.62 40.04,53.2 U1.P$59
  Bottom 0.254: v27.22,60.89 27.22,64.7 v24.68,67.24
RST  (via drill 0.6)
  Top 0.254: 15.79,25.25 U$1.30 15.86,31.68 C15.1 15.79,31.68 15.79,32.95 | U1.P$71 55.09,58.42 57.7,55.81 v58.97,55.81 | 15.79,32.95 v58.97,32.95 | R7.2 15.79,34.22 15.79,32.95
  Bottom 0.254: v58.97,55.81 v58.97,32.95
RX  (via drill 0.6)
  Top 0.254: U4.34 85.64,21.41 v85.64,17.71
  Bottom 0.254: J4.2 84.37,16.44 v85.64,17.71
S_CLK  (via drill 0.6)
  Top 0.254: U4.29 79.29,21.41 v79.29,34.22 | J2.12 R13.2
  Bottom 0.254: v79.29,34.22 80.56,35.49 80.56,74.56 72.64,82.48 J2.12
S_DAT  (via drill 0.6)
  Top 0.254: U4.31 81.83,21.41 v81.83,24.06 | J2.10 R4.2
  Bottom 0.254: J2.10 71.67,77.4 78.02,71.05 78.02,27.65 81.61,24.06 v81.83,24.06
S_LAT  (via drill 0.6)
  Top 0.254: U4.8 81.83,39.41 81.83,38.56 80.03,36.76 v79.29,36.76 | J2.11 R12.2
  Bottom 0.254: J2.11 72.41,79.94 79.29,73.06 v79.29,36.76
SC
  Top 0.254: U1.P$68 51.35,56.02 55.37,52 66.29,52 67.86,50.43 67.86,17.71 74.21,11.36 R1.1
SI
  Top 0.254: U1.P$69 52.62,56.82 56.17,53.27 66.29,53.27 69.13,50.43 69.13,18.98 76.75,11.36 R3.1
SO
  Top 0.254: U1.P$70 53.89,57.62 56.97,54.54 66.38,54.54 70.4,50.52 70.4,21.39 78.02,13.9 80.03,13.9 81.83,12.1 R2.1
TX  (via drill 0.6)
  Top 0.254: U4.35 86.91,21.41 v86.91,18.98
  Bottom 0.254: v86.91,18.98 J4.1
VCC  (via drill 0.6)
  Top 0.254: U$3.26 2.46,51.36 1.82,50.73 1.82,49.46 2.46,48.82 U$3.28 3.94,45.65 C17.1 4.04,40.36 7.64,36.76 v9.44,36.76 | 32.94,95.5 U$2.28 32.94,97.97 35.23,100.26 54.11,100.26 60.24,94.12 60.24,87.83 | U1.P$58 39.24,48.51 39.92,47.83 C6.1 41.17,45.33 44.66,41.84 v52.62,41.84 | R7.1 13.25,34.22 v13.25,36.76 27.22,36.76 29.76,34.22 v52.62,34.22 v61.51,34.22 61.51,32 C22.1 61.83,27.72 U$1.1 | U2.19 79.03,86.55 79.29,86.29 79.29,83.75 | 79.29,57.08 79.29,83.75 | C19.1 79.29,83.75 | U6.19 60.24,87.83 | J1.2 79.29,57.08 | 79.29,46.92 v76.75,46.92 74.51,46.92 71.67,49.76 71.67,50.73 64.05,58.22 64.05,71.14 60.24,74.95 60.24,85.02 | 79.29,46.92 79.29,57.08 | IC2.1 85.87,45.63 84.26,47.24 C5.1 83.1,46.92 79.29,46.92 | 60.24,85.02 60.24,87.83 | C21.1 60.24,85.02
  Top 0.61: v15.79,93.91 S5.2 | v24.68,93.91 28.49,93.91 | 28.49,93.91 C18.1 | 28.49,93.91 32.94,93.91 U$2.28
  Bottom 0.254: v52.62,34.22 v52.62,41.84 | v9.44,36.76 v13.25,36.76 | v61.51,34.22 69.34,34.22 76.75,41.62 v76.75,46.92
  Bottom 0.61: v24.68,93.91 v15.79,93.91
VIN  (via drill 0.6)
  Top 0.254: 14.52,25.25 U$1.31 14.36,27.86 13.08,29.14 11.98,29.14 10.71,30.41 10.71,36.23 12.51,38.03 28.49,38.03 31.03,35.49 v45,35.49 | v45,43.11 41.64,46.47 U1.P$61
  Bottom 0.254: v45,43.11 v45,35.49
VUSB
  Top 0.254: 9.44,103.14 J20.VBUS2 9.53,98.99 | J20.VBUS1 14.43,100.72 12.7,98.99 9.53,98.99 | S5.1 6.45,95.91 9.53,98.99
WR  (via drill 0.6)
  Top 0.254: U1.P$78 49.02,64.02 51.35,66.35 51.35,67.24 53.89,69.78 v53.89,73.59 53.89,95.18 50.08,98.99 35.37,98.99 33.57,97.19 33.57,96.45 34.2,95.81 U$2.27 | U$1.3 56.43,25.25 v56.43,29.14
  Bottom 0.254: v56.43,29.14 56.43,71.05 v53.89,73.59
X0
  Top 0.254: C11.1 58.02,59.75 Q1.2 52.35,60.02 U1.P$73
X1
  Top 0.254: C12.1 58.02,64.57 Q1.1 48.87,60.82 U1.P$74

### Text on the board
Top: SuperDMG | by k_iwanowski | cc-by-sa 2022